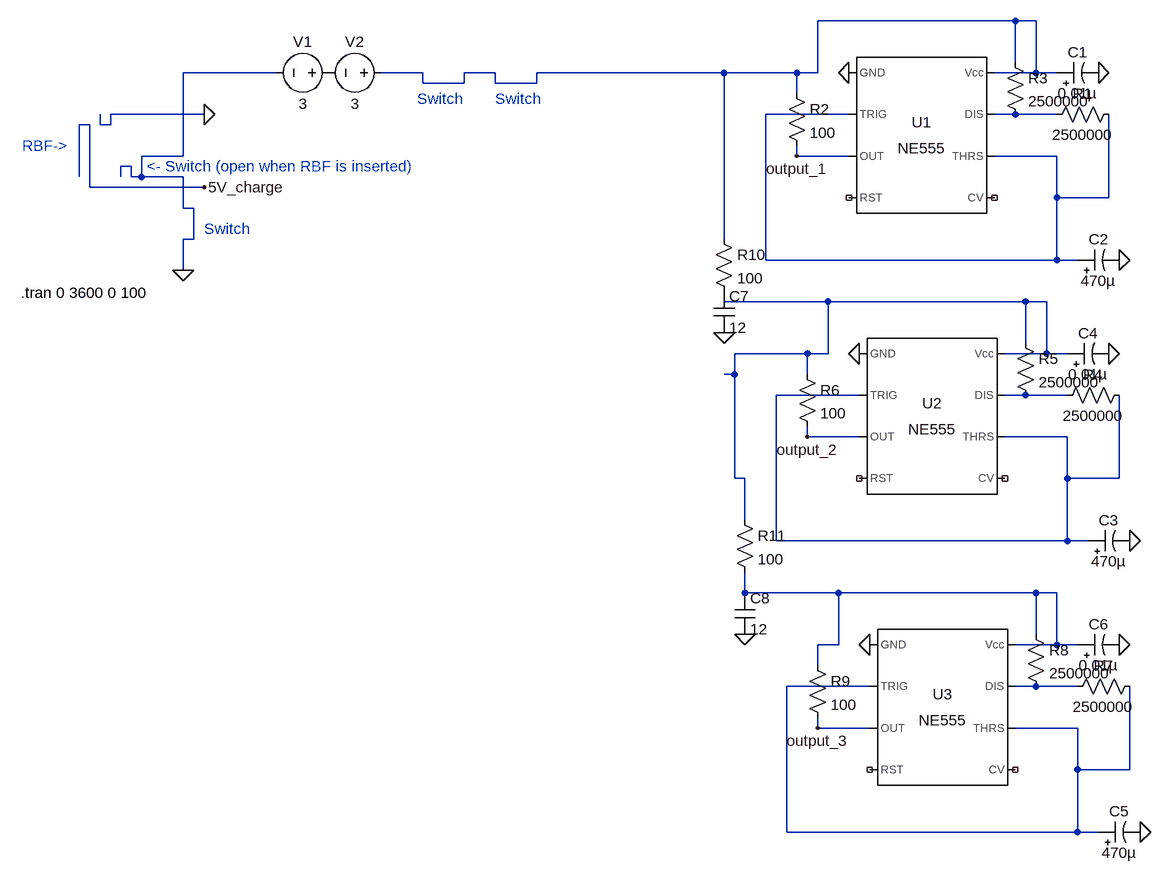
[diagram p0: schematic RBF_Logic.asc]
RBF_Logic.asc, the LTspice schematic file:
Version 4
SHEET 1 1524 1104
WIRE 1312 -192 1008 -192
WIRE 1344 -192 1312 -192
WIRE 1312 -128 1312 -192
WIRE 176 -112 32 -112
WIRE 400 -112 336 -112
WIRE 512 -112 464 -112
WIRE 864 -112 576 -112
WIRE 976 -112 864 -112
WIRE 1008 -112 1008 -192
WIRE 1008 -112 976 -112
WIRE 1344 -112 1344 -192
WIRE 1344 -112 1280 -112
WIRE 1376 -112 1344 -112
WIRE 400 -96 400 -112
WIRE 464 -96 464 -112
WIRE 464 -96 400 -96
WIRE 512 -96 512 -112
WIRE 576 -96 576 -112
WIRE 576 -96 512 -96
WIRE 976 -80 976 -112
WIRE 64 -48 -80 -48
WIRE 1056 -48 928 -48
WIRE 1312 -48 1280 -48
WIRE 1376 -48 1312 -48
WIRE -112 -32 -128 -32
WIRE -96 -32 -96 -48
WIRE -80 -32 -80 -48
WIRE -80 -32 -96 -32
WIRE 32 16 32 -112
WIRE 32 16 -32 16
WIRE 976 16 976 0
WIRE 1056 16 976 16
WIRE 1376 16 1280 16
WIRE -48 32 -64 32
WIRE -128 48 -128 -32
WIRE -64 48 -64 32
WIRE -48 48 -48 32
WIRE -32 48 -32 16
WIRE -32 48 -48 48
WIRE 32 48 -32 48
WIRE -112 64 -112 -32
WIRE 64 64 -112 64
WIRE 1376 80 1376 16
WIRE 1456 80 1456 -48
WIRE 1456 80 1376 80
WIRE 32 96 32 48
WIRE 48 96 32 96
WIRE 48 144 48 96
WIRE 48 144 32 144
WIRE 864 144 864 -112
WIRE 928 176 928 -48
WIRE 1376 176 1376 80
WIRE 1376 176 928 176
WIRE 1408 176 1376 176
WIRE 32 192 32 144
WIRE 1024 240 864 240
WIRE 1328 240 1024 240
WIRE 1360 240 1328 240
WIRE 1328 304 1328 240
WIRE 992 320 880 320
WIRE 1024 320 1024 240
WIRE 1024 320 992 320
WIRE 1360 320 1360 240
WIRE 1360 320 1296 320
WIRE 1392 320 1360 320
WIRE 880 352 880 320
WIRE 880 352 864 352
WIRE 992 352 992 320
WIRE 1072 384 944 384
WIRE 1328 384 1296 384
WIRE 1392 384 1328 384
WIRE 992 448 992 432
WIRE 1072 448 992 448
WIRE 1392 448 1296 448
WIRE 880 512 880 352
WIRE 896 512 880 512
WIRE 1392 512 1392 448
WIRE 1472 512 1472 384
WIRE 1472 512 1392 512
WIRE 896 576 896 512
WIRE 944 608 944 384
WIRE 1392 608 1392 512
WIRE 1392 608 944 608
WIRE 1424 608 1392 608
WIRE 896 688 896 656
WIRE 1040 688 896 688
WIRE 1344 688 1040 688
WIRE 1376 688 1344 688
WIRE 1344 752 1344 688
WIRE 1040 768 1040 688
WIRE 1040 768 1008 768
WIRE 1376 768 1376 688
WIRE 1376 768 1312 768
WIRE 1408 768 1376 768
WIRE 1008 800 1008 768
WIRE 1088 832 960 832
WIRE 1344 832 1312 832
WIRE 1408 832 1344 832
WIRE 1008 896 1008 880
WIRE 1088 896 1008 896
WIRE 1408 896 1312 896
WIRE 1408 960 1408 896
WIRE 1488 960 1488 832
WIRE 1488 960 1408 960
WIRE 960 1056 960 832
WIRE 1408 1056 1408 960
WIRE 1408 1056 960 1056
WIRE 1440 1056 1408 1056
FLAG 64 64 5V_charge
FLAG 64 -48 0
FLAG 1056 -112 0
FLAG 1440 -112 0
FLAG 1472 176 0
FLAG 32 192 0
FLAG 1072 320 0
FLAG 1456 320 0
FLAG 1488 608 0
FLAG 1088 768 0
FLAG 1472 768 0
FLAG 1504 1056 0
FLAG 864 288 0
FLAG 896 752 0
FLAG 1008 896 output_3
FLAG 976 16 output_1
FLAG 992 448 output_2
SYMBOL voltage 272 -112 R90
WINDOW 0 -32 56 VBottom 2
WINDOW 3 32 56 VTop 2
WINDOW 123 0 0 Left 0
WINDOW 39 0 0 Left 0
SYMATTR InstName V1
SYMATTR Value 3
SYMBOL voltage 352 -112 R90
WINDOW 0 -32 56 VBottom 2
WINDOW 3 32 56 VTop 2
WINDOW 123 0 0 Left 0
WINDOW 39 0 0 Left 0
SYMATTR InstName V2
SYMATTR Value 3
SYMBOL Misc\\NE555 1168 -16 R0
SYMATTR InstName U1
SYMBOL res 1472 -64 R90
WINDOW 0 0 56 VBottom 2
WINDOW 3 32 56 VTop 2
SYMATTR InstName R1
SYMATTR Value 2500000
SYMBOL polcap 1408 192 R270
WINDOW 0 32 32 VTop 2
WINDOW 3 0 32 VBottom 2
SYMATTR InstName C2
SYMATTR Value 470µ
SYMBOL res 1296 -144 R0
SYMATTR InstName R3
SYMATTR Value 2500000
SYMBOL res 960 -96 R0
SYMATTR InstName R2
SYMATTR Value 100
SYMBOL polcap 1376 -96 R270
WINDOW 0 32 32 VTop 2
WINDOW 3 0 32 VBottom 2
SYMATTR InstName C1
SYMATTR Value 0.01µ
SYMBOL Misc\\NE555 1184 416 R0
SYMATTR InstName U2
SYMBOL res 1488 368 R90
WINDOW 0 0 56 VBottom 2
WINDOW 3 32 56 VTop 2
SYMATTR InstName R4
SYMATTR Value 2500000
SYMBOL polcap 1424 624 R270
WINDOW 0 32 32 VTop 2
WINDOW 3 0 32 VBottom 2
SYMATTR InstName C3
SYMATTR Value 470µ
SYMBOL res 1312 288 R0
SYMATTR InstName R5
SYMATTR Value 2500000
SYMBOL res 976 336 R0
SYMATTR InstName R6
SYMATTR Value 100
SYMBOL polcap 1392 336 R270
WINDOW 0 32 32 VTop 2
WINDOW 3 0 32 VBottom 2
SYMATTR InstName C4
SYMATTR Value 0.01µ
SYMBOL Misc\\NE555 1200 864 R0
SYMATTR InstName U3
SYMBOL res 1504 816 R90
WINDOW 0 0 56 VBottom 2
WINDOW 3 32 56 VTop 2
SYMATTR InstName R7
SYMATTR Value 2500000
SYMBOL polcap 1440 1072 R270
WINDOW 0 32 32 VTop 2
WINDOW 3 0 32 VBottom 2
SYMATTR InstName C5
SYMATTR Value 470µ
SYMBOL res 1328 736 R0
SYMATTR InstName R8
SYMATTR Value 2500000
SYMBOL res 992 784 R0
SYMATTR InstName R9
SYMATTR Value 100
SYMBOL polcap 1408 784 R270
WINDOW 0 32 32 VTop 2
WINDOW 3 0 32 VBottom 2
SYMATTR InstName C6
SYMATTR Value 0.01µ
SYMBOL cap 848 224 R0
SYMATTR InstName C7
SYMATTR Value 12
SYMBOL res 848 128 R0
SYMATTR InstName R10
SYMATTR Value 100
SYMBOL res 880 560 R0
SYMATTR InstName R11
SYMATTR Value 100
SYMBOL cap 880 688 R0
SYMATTR InstName C8
SYMATTR Value 12
TEXT 64 128 Left 2 ;Switch
TEXT 392 -72 Left 2 ;Switch
TEXT 512 -72 Left 2 ;Switch
TEXT -24 32 Left 2 ;<- Switch (open when RBF is inserted)
TEXT -216 0 Left 2 ;RBF->
TEXT -218 226 Left 2 !.tran 0 3600 0 100

The netlist it stands for:
* RBF_Logic.asc
V1 P001 0 3
V2 N001 P001 3
XU1 0 N002 output_1 NC_01 NC_02 N002 N003 N001 NE555  ; pins GND TRIG OUT RST CV THRS DIS Vcc
R1 N002 N003 2500000
C2 N002 0 470µ
R3 N001 N003 2500000
R2 N001 output_1 100
C1 N001 0 0.01µ
XU2 0 N005 output_2 NC_03 NC_04 N005 N006 N004 NE555  ; pins GND TRIG OUT RST CV THRS DIS Vcc
R4 N005 N006 2500000
C3 N005 0 470µ
R5 N004 N006 2500000
R6 N004 output_2 100
C4 N004 0 0.01µ
XU3 0 N008 output_3 NC_05 NC_06 N008 N009 N007 NE555  ; pins GND TRIG OUT RST CV THRS DIS Vcc
R7 N008 N009 2500000
C5 N008 0 470µ
R8 N007 N009 2500000
R9 N007 output_3 100
C6 N007 0 0.01µ
C7 P002 0 12
R10 N001 P002 100
R11 N004 N007 100
C8 N007 0 12
* Switch
* Switch
* Switch
* <- Switch (open when RBF is inserted)
* RBF->
.tran 0 3600 0 100
.lib NE555.sub
.backanno
.end